# Altium schematic sheet USB_UART.SchDoc: USB UART
size 420 x 297 mm; DocumentNumber: 11; SheetNumber: 12; SheetTotal: 15
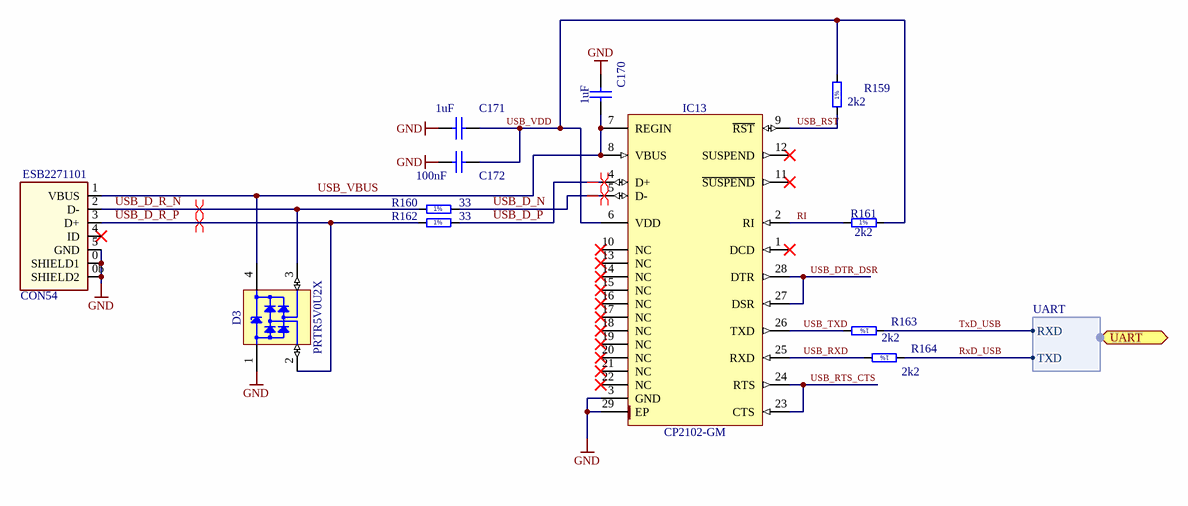
[diagram p0: USB_UART.SchDoc]

## Parts
C170  1uF  [CAPC1608X87N]
C171  1uF  [CAPC1608X87N]
C172  100nF  [CAPC0603X33N]
CON54  ESB2271101  [USB_MICRO_ESB2271101]
D3  PRTR5V0U2X  [SOT190P230X110-4N]
IC13  CP2102-GM  [QFN50P500X500X100-29N-S335]
R159  2k2  [RESC1005X40N]
R160  33  [RESC1005X40N]
R161  2k2  [RESC1005X40N]
R162  33  [RESC1005X40N]
R163  2k2  [RESC1005X40N]
R164  2k2  [RESC1005X40N]

## Ports
UART (harness UART)

## Harnesses
UART: RXD, TXD

## Nets
GND: C170.1 C171.1 C172.1 CON54.0(SHIELD1) CON54.0a(SHIELD1) CON54.0b(SHIELD2) CON54.0c(SHIELD2) CON54.5(GND) D3.1(GND) IC13.3(GND) IC13.29(EP)
RI: IC13.2(RI) R161.1
RxD_USB: R164.1 ; port UART.TXD
TxD_USB: R163.1 ; port UART.RXD
USB_D_N: IC13.5(D-) R160.2
USB_D_P: IC13.4(D+) R162.2
USB_D_R_N: CON54.2(D-) D3.3(I/O2) R160.1
USB_D_R_P: CON54.3(D+) D3.2(I/O1) R162.1
USB_DTR_DSR: IC13.27(DSR) IC13.28(DTR)
USB_RST: IC13.9(~{RST}) R159.1
USB_RTS_CTS: IC13.23(CTS) IC13.24(RTS)
USB_RXD: IC13.25(RXD) R164.2
USB_TXD: IC13.26(TXD) R163.2
USB_VBUS: C170.2 CON54.1(VBUS) D3.4(VCC) IC13.7(REGIN) IC13.8(VBUS)
USB_VDD: C171.2 C172.2 IC13.6(VDD) R159.2 R161.2

Not connected (* = marked no-connect by the designer): CON54 4(ID)*; IC13 1(DCD)* 10(NC)* 11(~{SUSPEND})* 12(SUSPEND)* 13(NC)* 14(NC)* 15(NC)* 16(NC)* 17(NC)* 18(NC)* 19(NC)* 20(NC)* 21(NC)* 22(NC)*

## Layout directives
differential pair: USB_D_N, USB_D_P, USB_D_R_N, USB_D_R_P

## Notes on the sheet
- Project/Equipment
- Document
- uTCA RTM 8 SFP+
- Designer
- Drawn by
- Check.by
- Copyright Creotech Instruments SA 2014.
  This documentation describes Open Hardware and is licensed under the CERN OHL v.1.1. You may redistribute and modify this documentation under the terms of the CERN OHL v.1.1. (http://ohwr.org/CERNOHL). This documentation is distributed WITHOUT ANY EXPRESS OR IMPLIED WARRANTY, INCLUDING OF MERCHANTABILITY, SATISFACTORY QUALITY AND FITNESS FOR A PARTICULAR PURPOSE. Please see the CERN OHL v.1.1 for applicable conditions.
- Creotech Instruments S.A.
- File
- Last Mod.
- Print Date
- Sheet
- Size
- A3
- of
- Rev
- (in symbol R0402_2K2_1%_0.0625W_100PPM) 1%
- (in symbol R0402_33R_1%_0.0625W_100PPM) 1%

## Library data of the parts
C170 C171 = CC0603_1UF_16V_10%_X7R: Non-polarised capacitor; Part Description: SMD Multilayer Chip Ceramic Capacitor; Manufacturer: GENERIC; Manufacturer1 Part Number: 223824613663; Voltage: 16V; TC: X7R; Tolerance: ±10%; Table: Capacitors SMD; Part Number: CC0603_1UF_16V_10%_X7R; Component Kind: Standard; Component Type: Standard; Pin Count: 2; Value: 1uF; Status: Preferred; Manufacturer Part Number: CC0603_1uF_16V_10%_X7R; Case: 0603; Mounted: Yes; Socket: No; SMD: Yes; Manufacturer1 Example: PHYCOMP; Manufacturer1 ComponentHeight: 0.87mm; HelpURL: \\cern.ch\dfs\Applications\Altium\Datasheets\CC0805_X5R_PHYCOMP_HC.pdf; Author: CERN DEM JLC; CreateDate: 2007-12-03; LatestRevisionDate: 2007-12-03
C172 = CC0201_100NF_6.3V_10%_X5R: Non-polarised capacitor; Part Description: SMD Multilayer Chip Ceramic Capacitor; Manufacturer: GENERIC; Manufacturer1 Part Number: 02016D104KAT2A; Voltage: 6.3V; TC: X5R; Tolerance: ±10%; Table: Capacitors SMD; Part Number: CC0201_100NF_6.3V_10%_X5R; Component Kind: Standard; Component Type: Standard; Pin Count: 2; Value: 100nF; Status: Not Recommended; Manufacturer Part Number: CC0201_100NF_6.3V_10%_X5R; Case: 0201; Mounted: Yes; Socket: No; SMD: Yes; Manufacturer1 Example: AVX; Manufacturer1 ComponentHeight: 0.33mm; HelpURL: \\cern.ch\dfs\Applications\Altium\Datasheets\CC0201_X5R_AVX.pdf; Author: CERN DEM JLC; CreateDate: 2007-12-03; LatestRevisionDate: 2007-12-03
CON54 = CON_USB_AB_MICRO: USB micro AB connector; Part Number: 10133; Device: USB_Mini_AB
D3 = PRTR5V0U2X: Ultra Low Capacitance Double Rail-to-Rail ESD Protection Diode; Part Description: Ultra Low Capacitance (1pF) Double Rail-to-Rail ESD Protection Diode (8kV); Manufacturer: NXP SEMICONDUCTORS; Voltage: 5.5V; Table: Diodes; Part Number: PRTR5V0U2X; Component Kind: Standard; Component Type: Standard; Device: PRTR5V0U2X; PackageDescription: SOT143B, SOT, 1.90mm Pitch; 4 Pin, 1.30mm W X 2.90mm L X 1.10mm H body, IPC Medium Density; Manufacturer Part Number: PRTR5V0U2X; Pin Count: 4; Case: SOT143B; Mounted: Yes; Socket: No; SMD: Yes; ComponentHeight: 1.1mm; HelpURL: \\cern.ch\dfs\Applications\Altium\Datasheets\PRTR5V0U2X.pdf; Author: CERN DEM JLC; CreateDate: 2011-03-22; LatestRevisionDate: 2011-03-22
IC13 = CP2102-GM: Single-Chip USB to UART Bridge; Manufacturer: SILICON LABS; Table: Analog & Interface; Part Number: CP2102-GM; Component Kind: Standard; Component Type: Standard; Device: CP2102-GM; PackageDescription: QFN, 0.50mm Pitch, Square; 28 pin, 5.00mm L X 5.00mm W X 1.00mm H body (w/thermal tab 3.35 X 3.35mm),  IPC Medium Density; Part Description: Single-Chip USB to UART Bridge; Manufacturer Part Number: CP2102-GM; Pin Count: 29; Case: QFN28; Mounted: Yes; Socket: No; SMD: Yes; ComponentHeight: 1.0mm; Author: CERN DEM JLC; HelpURL: \\cern.ch\dfs\Applications\Altium\Datasheets\CP2102-GM.pdf; CreateDate: 3/3/2011; LatestRevisionDate: 3/3/2011
R159 R161 R163 R164 = R0402_2K2_1%_0.0625W_100PPM: Resistor - 1%; Part Description: General Purpose Thick Film Chip Resistor; Manufacturer: GENERIC; Manufacturer1 Part Number: 232270672202L; TC: ±100ppm/°C; Table: Resistors SMD; Part Number: R0402_2K2_1%_0.0625W_100PPM; Component Kind: Standard; Component Type: Standard; Pin Count: 2; Value: 2k2; Status: Not recommended; Power: 0.0625W; Tolerance: ±1%; Manufacturer Part Number: R0402_2K2_1%_0.0625W_100PPM; Case: 0402; Mounted: Yes; Socket: No; SMD: Yes; Manufacturer1 Example: YAGEO PHYCOMP; Manufacturer1 ComponentHeight: 0.4mm; HelpURL: \\cern.ch\dfs\Applications\Altium\Datasheets\R0402_Phycomp_RC0402.pdf; Author: CERN DEM JLC; CreateDate: 2007-12-03; LatestRevisionDate: 2012-10-17
R160 R162 = R0402_33R_1%_0.0625W_100PPM: Resistor - 1%; Part Description: General Purpose Thick Film Chip Resistor; Manufacturer: GENERIC; Manufacturer1 Part Number: 232270673309L; TC: ±100ppm/°C; Table: Resistors SMD; Part Number: R0402_33R_1%_0.0625W_100PPM; Component Kind: Standard; Component Type: Standard; Pin Count: 2; Value: 33; Status: Not recommended; Power: 0.0625W; Tolerance: ±1%; Manufacturer Part Number: R0402_33R_1%_0.0625W_100PPM; Case: 0402; Mounted: Yes; Socket: No; SMD: Yes; Manufacturer1 Example: YAGEO PHYCOMP; Manufacturer1 ComponentHeight: 0.4mm; HelpURL: \\cern.ch\dfs\Applications\Altium\Datasheets\R0402_Phycomp_RC0402.pdf; Author: CERN DEM JLC; CreateDate: 2007-12-03; LatestRevisionDate: 2012-10-17